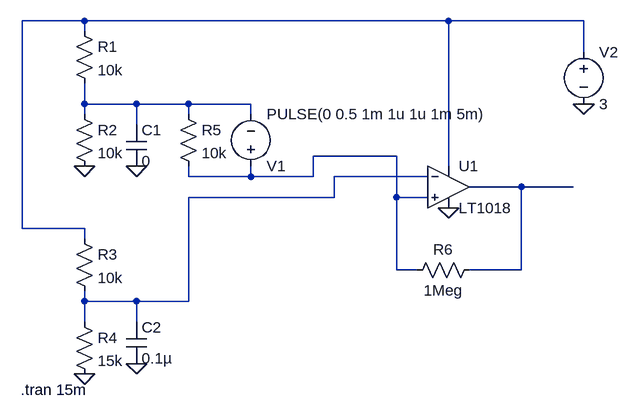
[diagram p0: schematic IR_UART_Comp.asc]
IR_UART_Comp.asc, the LTspice schematic file:
Version 4
SHEET 1 880 680
WIRE 48 48 -48 48
WIRE 608 48 48 48
WIRE 816 48 608 48
WIRE 48 64 48 48
WIRE 816 96 816 48
WIRE 48 176 48 144
WIRE 128 176 48 176
WIRE 208 176 128 176
WIRE 304 176 208 176
WIRE 48 192 48 176
WIRE 208 192 208 176
WIRE 304 192 304 176
WIRE 128 208 128 176
WIRE 528 256 400 256
WIRE 608 272 608 48
WIRE 208 288 208 272
WIRE 304 288 304 272
WIRE 304 288 208 288
WIRE 400 288 400 256
WIRE 400 288 304 288
WIRE 576 288 432 288
WIRE 720 304 640 304
WIRE 800 304 720 304
WIRE 432 320 432 288
WIRE 432 320 208 320
WIRE 528 320 528 256
WIRE 576 320 528 320
WIRE -48 368 -48 48
WIRE 48 368 -48 368
WIRE 48 384 48 368
WIRE 528 432 528 320
WIRE 560 432 528 432
WIRE 720 432 720 304
WIRE 720 432 640 432
WIRE 48 480 48 464
WIRE 128 480 48 480
WIRE 208 480 208 320
WIRE 208 480 128 480
WIRE 48 512 48 480
WIRE 128 512 128 480
FLAG 608 336 0
FLAG 816 176 0
FLAG 48 272 0
FLAG 48 592 0
FLAG 128 272 0
FLAG 128 576 0
SYMBOL res 32 48 R0
SYMATTR InstName R1
SYMATTR Value 10k
SYMBOL res 32 176 R0
SYMATTR InstName R2
SYMATTR Value 10k
SYMBOL res 32 368 R0
SYMATTR InstName R3
SYMATTR Value 10k
SYMBOL res 32 496 R0
SYMATTR InstName R4
SYMATTR Value 15k
SYMBOL res 192 176 R0
SYMATTR InstName R5
SYMATTR Value 10k
SYMBOL voltage 304 288 M180
WINDOW 123 0 0 Left 0
WINDOW 39 0 0 Left 0
SYMATTR InstName V1
SYMATTR Value PULSE(0 0.5 1m 1u 1u 1m 5m)
SYMBOL voltage 816 80 R0
SYMATTR InstName V2
SYMATTR Value 3
SYMBOL Comparators\\LT1018 608 304 R0
SYMATTR InstName U1
SYMBOL cap 112 208 R0
SYMATTR InstName C1
SYMATTR Value 0
SYMBOL cap 112 512 R0
SYMATTR InstName C2
SYMATTR Value 0.1µ
SYMBOL res 656 416 R90
WINDOW 0 0 56 VBottom 2
WINDOW 3 32 56 VTop 2
SYMATTR InstName R6
SYMATTR Value 1Meg
TEXT -50 616 Left 2 !.tran 15m

The netlist it stands for:
* IR_UART_Comp.asc
R1 N001 N002 10k
R2 N002 0 10k
R3 N001 N004 10k
R4 N004 0 15k
R5 N002 N003 10k
V1 N003 N002 PULSE(0 0.5 1m 1u 1u 1m 5m)
V2 N001 0 3
XU1 N003 N004 N001 0 N005 LT1018  ; pins In+ In- V+ V- OUT
C1 N002 0 0
C2 N004 0 0.1µ
R6 N005 N003 1Meg
.tran 15m
.lib LTC1.lib
.backanno
.end